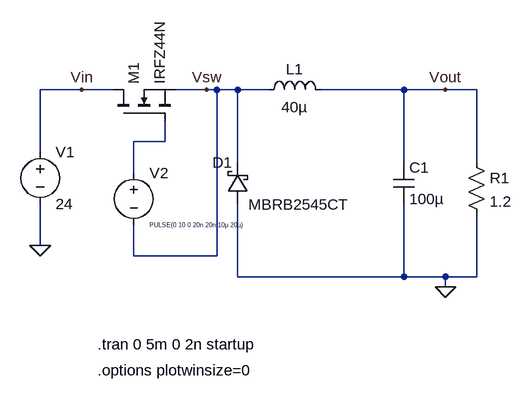
[diagram p0: schematic BUCK_converter.asc]
BUCK_converter.asc, the LTspice schematic file:
Version 4.1
SHEET 1 880 680
WIRE -128 -176 -192 -176
WIRE -80 -176 -128 -176
WIRE 64 -176 16 -176
WIRE 80 -176 64 -176
WIRE 112 -176 80 -176
WIRE 160 -176 112 -176
WIRE 368 -176 240 -176
WIRE 432 -176 368 -176
WIRE 480 -176 432 -176
WIRE 0 -96 0 -128
WIRE 0 -96 -48 -96
WIRE -192 -80 -192 -176
WIRE 112 -64 112 -176
WIRE 368 -64 368 -176
WIRE 480 -64 480 -176
WIRE -48 -48 -48 -96
WIRE -192 64 -192 0
WIRE -48 80 -48 32
WIRE 80 80 80 -176
WIRE 80 80 -48 80
WIRE 112 112 112 0
WIRE 368 112 368 0
WIRE 368 112 112 112
WIRE 432 112 368 112
WIRE 480 112 480 16
WIRE 480 112 432 112
WIRE 432 128 432 112
FLAG -192 64 0
FLAG 432 128 0
FLAG 64 -176 Vsw
FLAG 432 -176 Vout
FLAG -128 -176 Vin
SYMBOL voltage -192 -96 R0
WINDOW 123 0 0 Left 0
WINDOW 39 0 0 Left 0
SYMATTR InstName V1
SYMATTR Value 24
SYMBOL ind 144 -160 R270
WINDOW 0 32 56 VTop 2
WINDOW 3 5 56 VBottom 2
SYMATTR InstName L1
SYMATTR Value 40µ
SYMATTR SpiceLine Rser=1m
SYMBOL cap 352 -64 R0
SYMATTR InstName C1
SYMATTR Value 100µ
SYMBOL res 464 -80 R0
SYMATTR InstName R1
SYMATTR Value 1.2
SYMBOL schottky 128 0 R180
WINDOW 0 24 64 Left 2
WINDOW 3 -156 -1 Left 2
SYMATTR InstName D1
SYMATTR Value MBRB2545CT
SYMATTR Description Diode
SYMATTR Type diode
SYMBOL voltage -48 -64 R0
WINDOW 3 24 96 Left 0
WINDOW 123 0 0 Left 0
WINDOW 39 0 0 Left 0
SYMATTR InstName V2
SYMATTR Value PULSE(0 10 0 20n 20n 10µ 20µ)
SYMBOL nmos -80 -128 R270
SYMATTR InstName M1
SYMATTR Value IRFZ44N
TEXT -104 216 Left 2 !.tran 0 5m 0 2n startup
TEXT -104 256 Left 2 !.options plotwinsize=0

The netlist it stands for:
* BUCK_converter.asc
V1 Vin 0 24
L1 Vsw Vout 40µ Rser=1m
C1 Vout 0 100µ
R1 Vout 0 1.2
D1 0 Vsw MBRB2545CT
V2 N001 Vsw PULSE(0 10 0 20n 20n 10µ 20µ)
M1 Vin N001 Vsw Vsw IRFZ44N
.model D D
.lib standard.dio
.model NMOS NMOS
.model PMOS PMOS
.lib standard.mos
.tran 0 5m 0 2n startup
.options plotwinsize=0
.backanno
.end